# Altium schematic sheet 43.Flash-SPI FLASH(Option).SchDoc
size 297 x 209 mm; Revision: V2.1; Schematic Page Number: 11; Page Number: 26; Check: Default; Schematic Name: RK_NVR_DEMO1_RK3588_LP4/4x_V21; Page Count: 43; Page name: 43.Flash-SPI FLASH(Option); Designer: Zhangdz; Schematic Page Count: 99; Revcode: V2.1; DsnPath: E:\Work\SBER\RK3588_SOM\temp\RK_NVR_DEMO1_RK3588_LP4XD200P232SD8_V21_20211228.DSN; SchematicName: RK_NVR_DEMO1_RK3588_LP4/4x_V21; PageName: 43.Flash-SPI FLASH(Option); PageSize: A4; TopSchematic: True
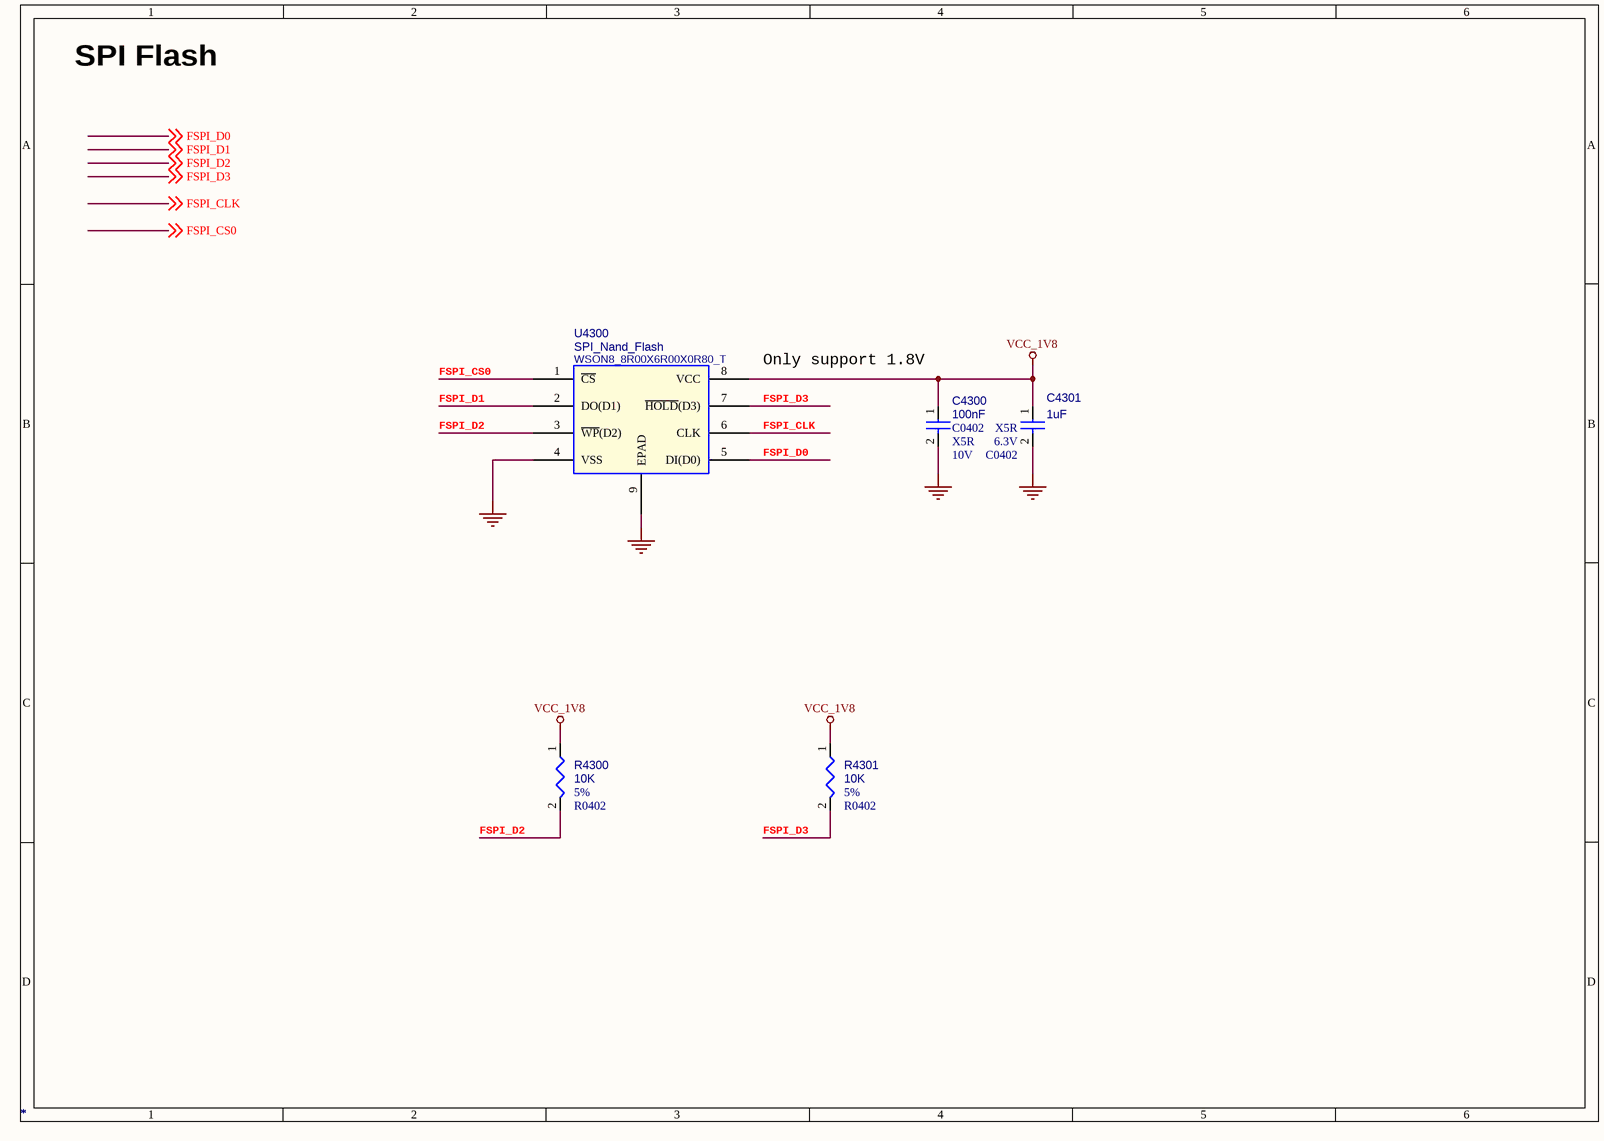
[diagram p0: 43.Flash-SPI FLASH(Option).SchDoc]

## Parts
C4300  *  Voltage: 10V  Dielectric: X5R  [C0402]
C4301  *  Voltage: 6.3V  Dielectric: X5R  [C0402]
R4300  *  Tolerance: 5%  [R0402]
R4301  *  Tolerance: 5%  [R0402]
U4300  *  [WSON8_8R00X6R00X0R80_T]

## Nets
GND: C4300.2 C4301.2 U4300.4(VSS) U4300.9(EPAD)
VCC_1V8: C4300.1 C4301.1 R4300.1 R4301.1 U4300.8(VCC)
FSPI_CLK: U4300.6(CLK) ; off-sheet FSPI_CLK
FSPI_CS0: U4300.1(~{CS}) ; off-sheet FSPI_CS0
FSPI_D0: U4300.5(DI(D0)) ; off-sheet FSPI_D0
FSPI_D1: U4300.2(DO(D1)) ; off-sheet FSPI_D1
FSPI_D2: R4300.2 U4300.3(~{WP}(D2)) ; off-sheet FSPI_D2
FSPI_D3: R4301.2 U4300.7(~{HOLD}(D3)) ; off-sheet FSPI_D3

## Notes on the sheet
- SPI Flash
- Only support 1.8V

## Library data of the parts
C4300 = CAP NP: cap,100.00nF,+/-10%,10V,X5R,C0402; Part Reference: C4300; Manufacturer: TDK; Value: 100nF; RK PN: C1005X5R1A104K050BA; Priority: A; Tolerance: 10%; PCB Footprint: C0402; Part Type: C0402; Manufacturer PN: C1005X5R1A104K050BA; Created by: JJJ
C4301 = CAP NP: cap,1.00uF,+/-10%,6.3V,X5R,C0402; Part Reference: C4301; Manufacturer: TDK; Value: 1uF; Number: 37; RK PN: C1005X5R0J105K050BB; Priority: A; Tolerance: 10%; PCB Footprint: C0402; Part Type: C0402; Manufacturer PN: C1005X5R0J105K050BB; C_Voltage: 6.3V; Created by: JJJ
R4300 = RESISTOR_Dup1: НЁУГєсД¤µзЧи,10K,+/-5%,R0402,1/16W.; Part Reference: R4300; Manufacturer PN: RC0402JR-0710KL; Manufacturer: YAGEO; Priority: A; Wattage: 1/16W; PCB Footprint: R0402; Value: 10K; Created by: YTL; Part Type: НЁУГєсД¤µзЧи; RK PN: RC0402JR-0710KL
R4301 = RESISTOR_Dup1: НЁУГєсД¤µзЧи,10K,+/-5%,R0402,1/16W.; Part Reference: R4301; Manufacturer: YAGEO; Wattage: 1/16W; RK PN: RC0402JR-0710KL; Priority: A; PCB Footprint: R0402; Value: 10K; Part Type: НЁУГєсД¤µзЧи; Manufacturer PN: RC0402JR-0710KL; Created by: YTL
U4300 = SPI_FLASH_8PIN_T_0: Part Reference: U4300; Value: SPI_Nand_Flash; Priority: A; PCB Footprint: WSON8_8R00X6R00X0R80_T; Part Type: SPI_FLASH; Created by: JJJ